# EAGLE design LoopAmp (EAGLE 9.0.0)
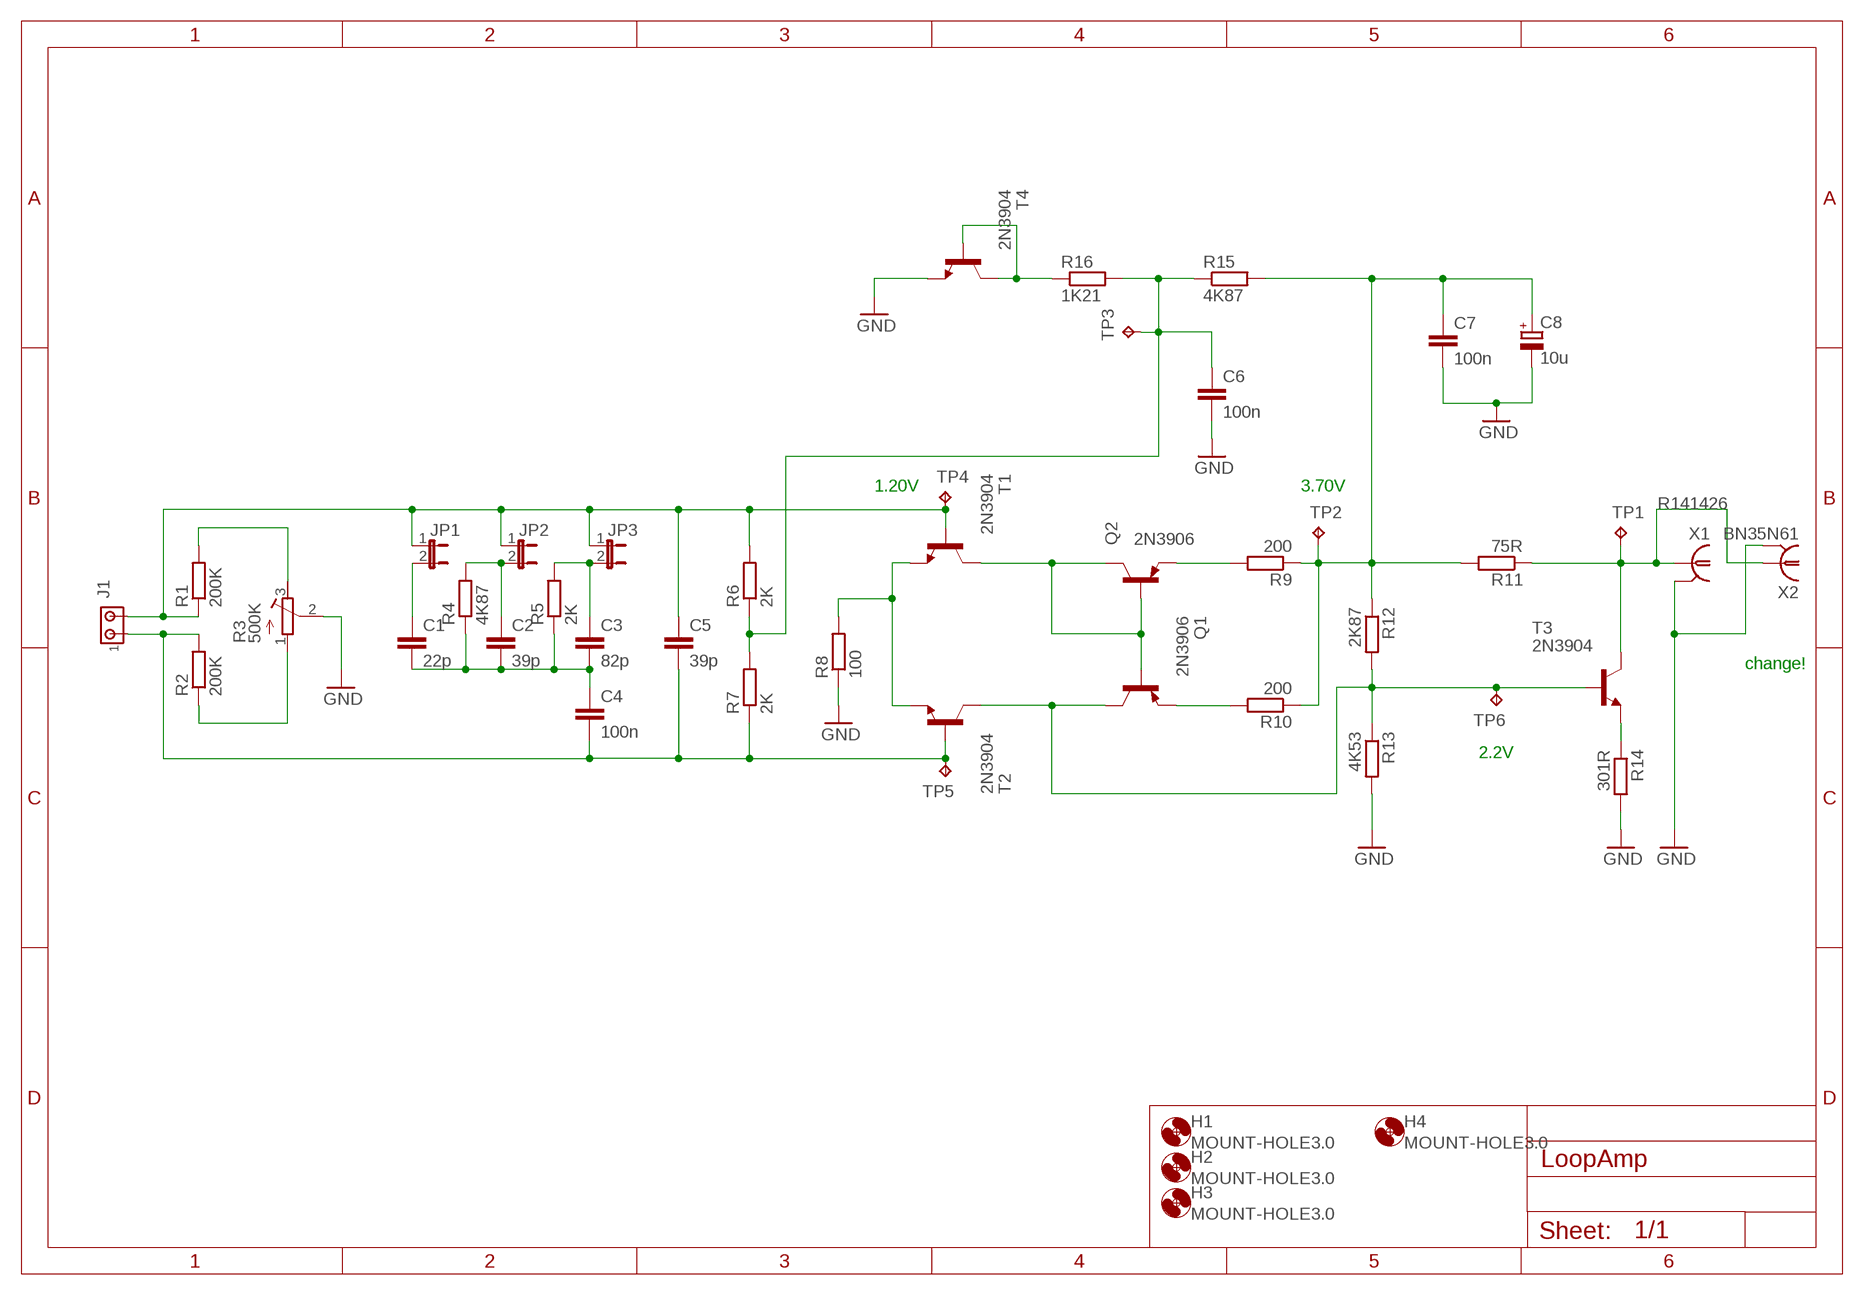
[diagram p0: schematic, sheet 1]

## Parts
C1  22p  C-EUC0805  [C0805]
C2  39p  C-EUC0805  [C0805]
C3  82p  C-EUC0805  [C0805]
C4  100n  C-EUC0805  [C0805]
C5  39p  C-EUC0805  [C0805]
C6  100n  C-EUC0805  [C0805]
C7  100n  C-EUC0805  [C0805]
C8  10u  CPOL-EUC  [PANASONIC_C]
H1  MOUNT-HOLE3.0  [3,0]
H2  MOUNT-HOLE3.0  [3,0]
H3  MOUNT-HOLE3.0  [3,0]
H4  MOUNT-HOLE3.0  [3,0]
J1  MTA02-156  [1X2MTA]
JP1  JP1E  [JP1]
JP2  JP1E  [JP1]
JP3  JP1E  [JP1]
Q1  2N3906  [TO92]
Q2  2N3906  [TO92]
R1  200K  R-EU_R0805  [R0805]
R2  200K  R-EU_R0805  [R0805]
R3  500K  R-TRIMM64W  [RTRIM64W]
R4  4K87  R-EU_R0805  [R0805]
R5  2K  R-EU_R0805  [R0805]
R6  2K  R-EU_R0805  [R0805]
R7  2K  R-EU_R0805  [R0805]
R8  100  R-EU_R0805  [R0805]
R9  200  R-EU_R0805  [R0805]
R10  200  R-EU_R0805  [R0805]
R11  75R  R-EU_R0805  [R0805]
R12  2K87  R-EU_R0805  [R0805]
R13  4K53  R-EU_R0805  [R0805]
R14  301R  R-EU_R0805  [R0805]
R15  4K87  R-EU_R0805  [R0805]
R16  1K21  R-EU_R0805  [R0805]
T1  2N3904  [TO92]
T2  2N3904  [TO92]
T3  2N3904  [TO92]
T4  2N3904  [TO92]
TP1  4.18V>  TPPAD1-13  [P1-13]
TP2  4.18V>  TPPAD1-13  [P1-13]
TP3  4.18V>  TPPAD1-13  [P1-13]
TP4  4.18V>  TPPAD1-13  [P1-13]
TP5  4.18V>  TPPAD1-13  [P1-13]
TP6  4.18V>  TPPAD1-13  [P1-13]
X1  R141426  [R141426]
X2  BN35N61  [B35N61]

## Nets
GND: C6.2 C7.2 C8.- R3.2(S) R8.1 R13.2 R14.2 T4.3(E) X1.2 X1.3 X1.4 X1.5 X2.2 X2.3 X2.4 X2.5
N$2: C4.2 C5.2 J1.1 R2.2 R7.1 T2.2(B) TP5.TP
N$3: C5.1 J1.2 JP1.1 JP2.1 JP3.1 R1.1 R6.2 T1.2(B) TP4.TP
N$4: R2.1 R3.1(A)
N$5: C1.1 JP1.2
N$6: C2.1 JP2.2 R4.2
N$7: C3.1 JP3.2 R5.2
N$8: C1.2 C2.2 C3.2 C4.1 R4.1 R5.1
N$9: R1.2 R3.3(E)
N$11: R8.2 T1.3(E) T2.3(E)
N$14: Q1.2(B) Q2.1(C) Q2.2(B) T1.1(C)
N$15: R11.1 T3.1(C) TP1.TP X1.1 X2.1
N$16: C7.1 C8.+ R9.1 R10.1 R11.2 R12.1 R15.2 TP2.TP
N$17: Q2.3(E) R9.2
N$18: Q1.3(E) R10.2
N$20: Q1.1(C) R12.2 R13.1 T2.1(C) T3.2(B) TP6.TP
N$21: R14.1 T3.3(E)
N$23: C6.1 R6.1 R7.2 R15.1 R16.2 TP3.TP
N$24: R16.1 T4.1(C) T4.2(B)

## Notes on the sheet
- 1.20V | 3.70V
- change!
- 2.2V

## Library data of the parts
C1-C7 = rcl:C-EU: CAPACITOR, European symbol; SPICEPREFIX: C
C8 = rcl:CPOL-EU: POLARIZED CAPACITOR, European symbol; SPICEPREFIX: C
H1-H4 = holes:MOUNT-HOLE: MOUNTING HOLE with drill center marker
J1 = con-amp:MTA02-156: AMP connector
JP1-JP3 = jumper:JP1E: JUMPER
Q1 Q2 = transistor-pnp:2N3906: PNP Transistor
R1 R2 R4-R16 = rcl:R-EU_: RESISTOR, European symbol; SPICEPREFIX: R
R3 = rcl:R-TRIMM: Trimm resistor; SPICEMODEL: X; SPICEPREFIXL: POT
T1-T4 = transistor:2N3904: NPN TRANSISTOR
TP1-TP6 = testpad:TP: Test pad
X1 = con-coax:R141426: BNC COAX CONNECTOR Radiall 50/75 Ohm Spoerle; MF: FARNELL; MPN: R141426161; OC_FARNELL: 4195115; OC_NEWARK: 14J7919
X2 = con-coax:BN35N61: BNC CONNECTOR M/A COM www.macom.com distributor Farnell 149-452; OC_FARNELL: unknown; OC_NEWARK: unknown

## Net classes
0 default: width 0.254 mm

## Board
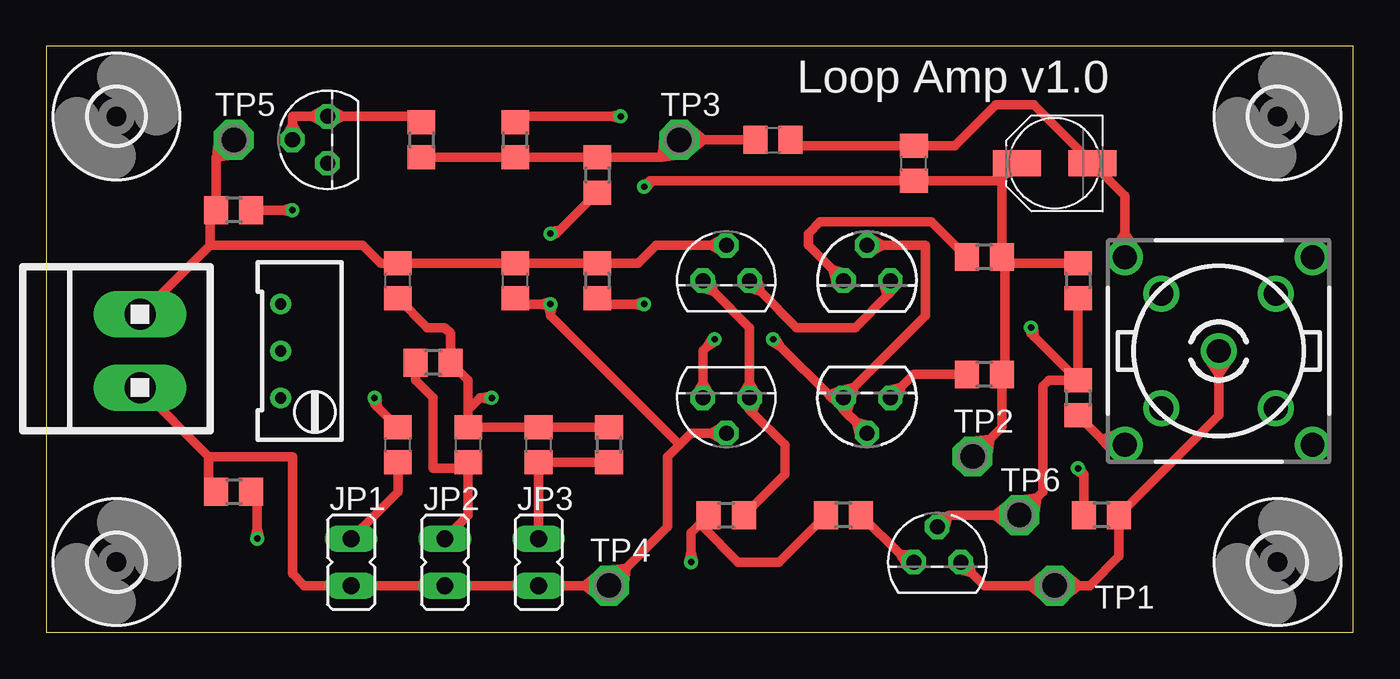
[diagram p1: board, top side]
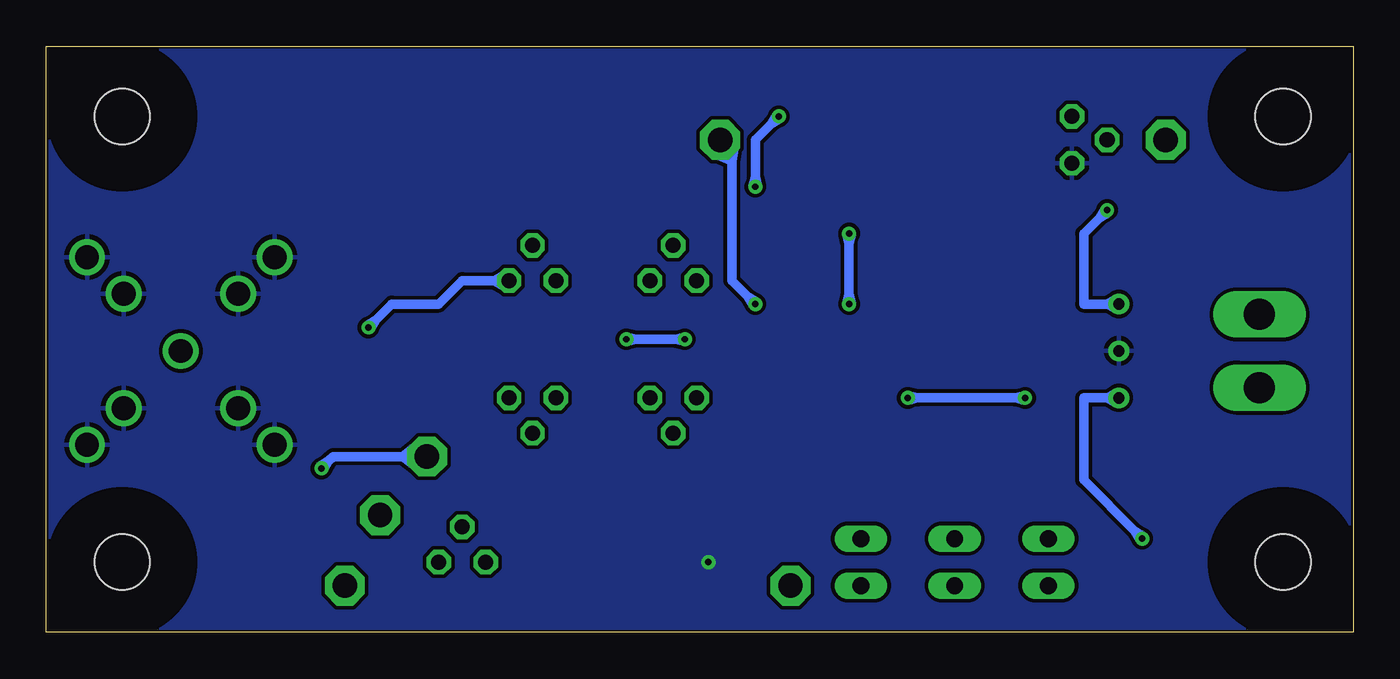
[diagram p2: board, bottom side, seen from below]

Size 70.79 x 31.74 mm. Coordinates in mm from the lower left corner, seen from the top.
Outline: 0,0 70.79,0 70.79,31.74 0,31.74 0,0
Copper layers (1*16): Top 0.035mm / dielectric 1.5mm / Bottom 0.035mm
Design rules "default *": minimum track width 6mil, minimum drill 0.35mm, track to track 8mil, track to pad 8mil, pad to pad 8mil, via to via 8mil, smd to smd 6mil, copper to edge 5mil, drill to drill 6mil, minimum pad ring 10mil, minimum via ring 8mil, stop-mask expansion 4mil, vias tented up to drill 0mil, thermal gap 10mil

### Footprints (pad centres in the part's own frame; a part is rotated, then mirrored left to right if it is on the bottom)
C0805 = smd 1.3 x 1.5: 1 -0.95,0; 2 0.95,0
PANASONIC_C = smd 2.6 x 1.4: + 2.05,0; - -2.05,0
3,0 = hole 3: 0,0
1X2MTA = drill 1.676 long: 1 1.981,0; 2 -1.981,0
JP1 = drill 0.914 long: 1 0,-1.27; 2 0,1.27
TO92 = drill 0.813 octagon: 1 1.27,0; 2 0,1.905; 3 -1.27,0
R0805 = smd 1.3 x 1.5: 1 -0.95,0; 2 0.95,0
RTRIM64W = drill 0.61: 1 1.27,-2.54; 2 1.27,0; 3 1.27,2.54
P1-13 = drill 1.321 pad 2.159 octagon: TP 0,0
R141426 = drill 1.295: 1 0,0; 2 5.08,5.08; 3 -5.08,5.08; 4 -5.08,-5.08; 5 5.08,-5.08
B35N61 = drill 1.2: 1 0,0 | drill 1.3: 2 3.099,3.099; 3 -3.099,3.099; 4 -3.099,-3.099; 5 3.099,-3.099

### Placement (x,y rotation side)
C1  19.05,10.16 90 top
C2  22.86,10.16 90 top
C3  26.67,10.16 90 top
C4  19.05,19.05 90 top
C5  25.4,19.05 90 top
C6  39.37,26.67 0 top
C7  46.99,25.4 90 top
C8  54.61,25.4 180 top
H1  66.67,27.94 0 top
H2  66.67,3.81 0 top
H3  3.81,3.81 0 top
H4  3.81,27.94 0 top
J1  5.08,15.24 90 top
JP1  16.51,3.81 0 top
JP2  21.59,3.81 0 top
JP3  26.67,3.81 0 top
Q1  44.45,19.05 0 top
Q2  44.45,12.7 180 top
R1  10.16,7.62 0 top
R2  10.16,22.86 180 top
R3  13.97,15.24 180 top
R4  20.95,14.61 180 top
R5  30.48,10.16 270 top
R6  29.84,24.77 270 top
R7  29.84,19.05 270 top
R8  36.83,6.35 0 top
R9  50.8,13.97 180 top
R10  50.8,20.32 180 top
R11  57.15,6.35 180 top
R12  55.88,19.05 270 top
R13  55.88,12.7 270 top
R14  43.18,6.35 180 top
R15  25.4,26.67 90 top
R16  20.32,26.67 270 top
T1  36.83,12.7 180 top
T2  36.83,19.05 0 top
T3  48.26,3.81 0 top
T4  15.24,26.67 90 top
TP1  54.61,2.54 0 top
TP2  50.16,9.53 0 top
TP3  34.29,26.67 0 top
TP4  30.48,2.54 0 top
TP5  10.16,26.67 0 top
TP6  52.7,6.35 0 top
X1  63.5,15.24 180 top
X2  63.5,15.24 0 top

### Tracks (layer width: path | path; a pad name or v marks a point on that pad's centre or on a via)
GND  (via drill 0.35)
  Top 0.508: C6.2 40.64,26.35 C7.2 49.21,26.35 51.44,28.57 53.48,28.57 C8.- 58.42,23.64 58.42,21.61 | 42.55,6.67 R14.2 39.69,3.81 37.47,3.81 35.56,5.71 35.88,6.04 R8.1 34.92,5.39 34.92,4.33 | R13.2 57.16,10.47 | 57.16,10.47 57.47,10.16 X1.2 | 34.92,4.33 v34.92,3.81 | 58.42,21.61 X1.5 | 34.92,4.33 34.8,3.84 v34.92,3.81 | 34.92,4.33 35.05,3.84 v34.92,3.81 | 57.16,10.47 57.89,9.67 X1.2 | 57.16,10.47 58.18,10.84 X1.2 | 58.42,21.61 57.82,20.72 X1.5 | 58.42,21.61 59.02,20.72 X1.5
  pour Bottom: -1.27,-1.27 -1.27,33.02 76.2,33.02 76.2,-1.27
N$2
  Top 0.508: J1.1 5.16,17.22 8.89,20.95 | 8.89,20.95 17.14,20.95 18.1,20 C4.2 C5.2 R7.1 32.06,20 33.02,20.95 36.02,20.95 | 36.02,20.95 T2.2 | 8.89,20.95 8.89,22.54 R2.2 9.21,25.72 9.23,25.74 | 9.23,25.74 TP5.TP | 36.02,20.95 36.63,20.6 T2.2 | 36.02,20.95 36.63,21.31 T2.2 | 9.23,25.74 10.25,25.85 TP5.TP | 9.23,25.74 9.34,26.76 TP5.TP
N$3  (via drill 0.35)
  Top 0.508: J1.2 8.81,9.53 | 8.81,9.53 13.34,9.53 13.34,3.17 13.97,2.54 JP1.1 JP2.1 JP3.1 29.16,2.54 | 29.16,2.54 TP4.TP | TP4.TP 31.41,3.47 | 31.41,3.47 33.66,5.71 33.66,9.53 34.29,10.16 | 34.29,10.16 34.92,10.79 36.02,10.79 | 36.02,10.79 T1.2 | R1.1 8.81,8.02 8.81,9.53 | R6.2 27.8,21.77 | 27.8,21.77 27.62,21.59 v27.3,21.59 | v27.3,17.78 26.78,17.78 | 26.78,17.78 25.72,17.78 C5.1 | v27.3,17.78 27.3,17.25 | 27.3,17.25 27.3,17.14 34.29,10.16 | 27.8,21.77 27.29,21.71 v27.3,21.59 | 27.8,21.77 27.37,21.49 v27.3,21.59 | 26.78,17.78 27.28,17.66 v27.3,17.78 | 26.78,17.78 27.28,17.9 v27.3,17.78 | 27.3,17.25 27.43,17.75 v27.3,17.78 | 27.3,17.25 27.18,17.75 v27.3,17.78 | 36.02,10.79 36.63,10.44 T1.2 | 36.02,10.79 36.63,11.15 T1.2 | 29.16,2.54 29.96,1.9 TP4.TP | 29.16,2.54 29.96,3.18 TP4.TP | 31.41,3.47 30.39,3.36 TP4.TP | 31.41,3.47 31.3,2.45 TP4.TP
  Bottom 0.508: v27.3,21.59 27.3,21.07 | 27.3,21.07 27.3,18.3 | 27.3,18.3 v27.3,17.78 | 27.3,21.07 27.43,21.56 v27.3,21.59 | 27.3,21.07 27.18,21.56 v27.3,21.59 | 27.3,18.3 27.18,17.81 v27.3,17.78 | 27.3,18.3 27.43,17.81 v27.3,17.78
N$4  (via drill 0.35)
  Top 0.508: R2.1 12.81,22.86 | 12.81,22.86 v13.34,22.86 | 12.81,22.86 13.31,22.74 v13.34,22.86 | 12.81,22.86 13.31,22.98 v13.34,22.86
  Bottom 0.508: v13.34,22.86 13.71,22.49 | 13.71,22.49 14.61,21.59 14.61,17.78 13.31,17.78 | 13.31,17.78 R3.1 | 13.71,22.49 13.44,22.93 v13.34,22.86 | 13.71,22.49 13.27,22.75 v13.34,22.86 | 13.31,17.78 12.85,18.04 R3.1 | 13.31,17.78 12.85,17.52 R3.1
N$5
  Top 0.508: JP1.2 19.05,7.62 C1.1
N$6
  Top 0.508: JP2.2 22.86,6.35 C2.1 22.54,8.89 20.95,8.89 20.95,12.7 20,13.65 R4.2
N$7
  Top 0.508: JP3.2 C3.1 R5.2
N$8  (via drill 0.35)
  Top 0.508: C4.1 20.64,16.51 21.59,16.51 21.91,16.2 R4.1 22.86,13.65 22.86,12.06 | 22.86,12.06 C2.2 C3.2 R5.1 | C1.2 17.95,12.21 | 17.95,12.21 17.78,12.38 v17.78,12.7 | v24.13,12.7 23.61,12.7 | 23.61,12.7 23.5,12.7 22.86,12.06 | 17.95,12.21 17.9,12.71 v17.78,12.7 | 17.95,12.21 17.68,12.63 v17.78,12.7 | 23.61,12.7 24.1,12.58 v24.13,12.7 | 23.61,12.7 24.1,12.82 v24.13,12.7
  Bottom 0.508: v17.78,12.7 18.3,12.7 | 18.3,12.7 23.61,12.7 | 23.61,12.7 v24.13,12.7 | 18.3,12.7 17.81,12.82 v17.78,12.7 | 18.3,12.7 17.81,12.58 v17.78,12.7 | 23.61,12.7 24.1,12.58 v24.13,12.7 | 23.61,12.7 24.1,12.82 v24.13,12.7
N$9  (via drill 0.35)
  Top 0.508: R1.2 11.43,7.3 11.43,5.61 | 11.43,5.61 v11.43,5.08 | 11.43,5.61 11.31,5.11 v11.43,5.08 | 11.43,5.61 11.55,5.11 v11.43,5.08
  Bottom 0.508: v11.43,5.08 11.8,5.45 | 11.8,5.45 14.61,8.26 14.61,12.7 13.31,12.7 | 13.31,12.7 13.22,12.7 | 13.22,12.7 R3.3 | 11.8,5.45 11.37,5.19 v11.43,5.08 | 11.8,5.45 11.54,5.01 v11.43,5.08 | 13.22,12.7 12.73,12.82 R3.3 | 13.22,12.7 12.73,12.58 R3.3 | 13.31,12.7 12.85,12.96 R3.3 | 13.31,12.7 12.85,12.44 R3.3
  other vias: 12.7,12.7
N$11
  Top 0.508: R8.2 40.01,8.57 40.01,10.16 38.26,11.9 | 38.26,11.9 38.1,12.06 T1.3 | T2.3 36.13,18.48 | 36.13,18.48 38.1,16.51 38.1,13.51 | 38.1,13.51 T1.3 | 38.26,11.9 38.48,12.57 T1.3 | 38.26,11.9 37.8,12.43 T1.3 | 38.1,13.51 37.75,12.9 T1.3 | 38.1,13.51 38.45,12.9 T1.3 | 36.13,18.48 35.95,19.16 T2.3 | 36.13,18.48 35.45,18.66 T2.3
N$14  (via drill 0.35)
  Top 0.508: Q2.1 43.76,13.28 | 43.76,13.28 47.62,17.14 47.62,20.95 45.26,20.95 | 45.26,20.95 Q1.2 | T1.1 35.56,13.51 | 35.56,13.51 35.56,15.24 35.82,15.5 | 35.82,15.5 v36.2,15.88 | v39.37,15.88 39.74,15.5 | 39.74,15.5 42.38,12.86 | 42.38,12.86 42.55,12.7 Q2.1 | Q2.2 43.88,11.37 | 43.88,11.37 43.34,11.9 | 43.34,11.9 43.18,12.06 Q2.1 | 35.82,15.5 36.26,15.77 v36.2,15.88 | 35.82,15.5 36.09,15.94 v36.2,15.88 | 39.74,15.5 39.48,15.94 v39.37,15.88 | 39.74,15.5 39.3,15.77 v39.37,15.88 | 43.88,11.37 44.06,10.69 Q2.2 | 43.88,11.37 44.55,11.19 Q2.2 | 45.26,20.95 44.65,21.31 Q1.2 | 45.26,20.95 44.65,20.6 Q1.2 | 35.56,13.51 35.21,12.9 T1.1 | 35.56,13.51 35.91,12.9 T1.1 | 43.76,13.28 43.08,13.09 Q2.1 | 43.76,13.28 43.57,12.6 Q2.1 | 42.38,12.86 42.91,12.39 Q2.1 | 42.38,12.86 43.05,13.09 Q2.1 | 43.34,11.9 43.56,12.57 Q2.1 | 43.34,11.9 42.88,12.43 Q2.1
  Bottom 0.508: v36.2,15.88 36.72,15.88 | 36.72,15.88 38.84,15.88 | 38.84,15.88 v39.37,15.88 | 36.72,15.88 36.22,16 v36.2,15.88 | 36.72,15.88 36.22,15.75 v36.2,15.88 | 38.84,15.88 39.34,15.75 v39.37,15.88 | 38.84,15.88 39.34,16 v39.37,15.88
N$15
  Top 0.508: X2.1 63.5,14.04 | 63.5,14.04 63.5,13.95 | 63.5,13.95 63.5,11.75 R11.1 58.1,4.12 56.52,2.54 55.93,2.54 | 55.93,2.54 TP1.TP | TP1.TP 53.29,2.54 | 53.29,2.54 50.8,2.54 50.1,3.23 | 50.1,3.23 T3.1 | 63.5,13.95 64.1,14.84 X2.1 | 63.5,13.95 62.9,14.84 X2.1 | 50.1,3.23 49.92,3.92 T3.1 | 50.1,3.23 49.42,3.42 T3.1 | 55.93,2.54 55.13,3.18 TP1.TP | 55.93,2.54 55.13,1.9 TP1.TP | 53.29,2.54 54.09,1.9 TP1.TP | 53.29,2.54 54.09,3.18 TP1.TP | 63.5,14.04 64.04,14.89 X2.1 | 63.5,14.04 62.96,14.89 X2.1
N$16  (via drill 0.35)
  Top 0.508: 32.8,24.45 C7.1 51.61,24.45 51.75,24.59 | 32.8,24.45 32.7,24.45 v32.38,24.13 | v31.11,27.94 30.59,27.94 | 30.59,27.94 25.72,27.94 R15.2 | 51.75,24.59 R10.1 51.91,20.16 | 51.75,24.59 C8.+ | 51.1,10.46 51.75,11.11 R9.1 51.91,14.13 51.91,20.16 | 51.1,10.46 TP2.TP | v55.88,8.89 56.2,8.57 56.2,8.47 | 56.2,8.47 R11.2 | 51.91,20.16 52.07,20 R12.1 | 32.8,24.45 32.34,24.24 v32.38,24.13 | 32.8,24.45 32.48,24.05 v32.38,24.13 | 30.59,27.94 31.09,27.82 v31.11,27.94 | 30.59,27.94 31.09,28.06 v31.11,27.94 | 56.2,8.47 55.99,8.94 v55.88,8.89 | 56.2,8.47 55.8,8.79 v55.88,8.89 | 51.1,10.46 50.07,10.35 TP2.TP | 51.1,10.46 50.98,9.43 TP2.TP
  Bottom 0.508: v32.38,24.13 32.38,24.66 | 32.38,24.66 32.38,26.67 31.49,27.57 | 31.49,27.57 v31.11,27.94 | TP2.TP 51.49,9.53 | 51.49,9.53 55.24,9.53 55.51,9.26 | 55.51,9.26 v55.88,8.89 | 32.38,24.66 32.26,24.16 v32.38,24.13 | 32.38,24.66 32.51,24.16 v32.38,24.13 | 31.49,27.57 31.22,28 v31.11,27.94 | 31.49,27.57 31.05,27.83 v31.11,27.94 | 55.51,9.26 55.77,8.82 v55.88,8.89 | 55.51,9.26 55.95,9 v55.88,8.89 | 51.49,9.53 50.68,10.17 TP2.TP | 51.49,9.53 50.68,8.88 TP2.TP
N$17
  Top 0.508: Q2.3 46.3,13.28 | 46.3,13.28 46.99,13.97 R9.2 | 46.3,13.28 45.62,13.09 Q2.3 | 46.3,13.28 46.11,12.6 Q2.3
N$18
  Top 0.508: R10.2 47.95,22.23 41.91,22.23 41.27,21.59 41.27,20.95 42.6,19.62 | 42.6,19.62 Q1.3 | 42.6,19.62 42.79,18.95 Q1.3 | 42.6,19.62 43.28,19.44 Q1.3
N$20  (via drill 0.35)
  Top 0.508: T3.2 48.84,6.29 | 48.84,6.29 48.9,6.35 51.38,6.35 | 51.38,6.35 TP6.TP | TP6.TP 53.64,7.28 | 53.64,7.28 53.98,7.62 53.98,13.34 54.29,13.65 R13.1 | T2.1 38.67,18.48 | 38.67,18.48 40.64,16.51 43.81,16.51 45.56,18.25 | 45.56,18.25 45.72,18.41 Q1.1 | R13.1 R12.2 | R13.1 53.52,16.02 | 53.52,16.02 53.34,16.19 v53.34,16.51 | 53.52,16.02 53.46,16.52 v53.34,16.51 | 53.52,16.02 53.24,16.44 v53.34,16.51 | 45.56,18.25 46.02,18.78 Q1.1 | 45.56,18.25 45.34,18.92 Q1.1 | 38.67,18.48 38.49,19.16 T2.1 | 38.67,18.48 37.99,18.66 T2.1 | 48.84,6.29 48.16,6.11 T3.2 | 48.84,6.29 48.65,5.61 T3.2 | 51.38,6.35 52.19,5.71 TP6.TP | 51.38,6.35 52.19,6.99 TP6.TP | 53.64,7.28 52.61,7.17 TP6.TP | 53.64,7.28 53.52,6.26 TP6.TP
  Bottom 0.508: v53.34,16.51 52.97,16.88 | 52.97,16.88 52.07,17.78 49.53,17.78 48.26,19.05 46.53,19.05 | 46.53,19.05 Q1.1 | 52.97,16.88 53.23,16.45 v53.34,16.51 | 52.97,16.88 53.41,16.62 v53.34,16.51 | 46.53,19.05 45.92,19.4 Q1.1 | 46.53,19.05 45.92,18.7 Q1.1
N$21
  Top 0.508: R14.1 46.28,4.2 | 46.28,4.2 46.67,3.81 T3.3 | 46.28,4.2 46.64,3.6 T3.3 | 46.28,4.2 46.98,4.22 T3.3
N$23  (via drill 0.35)
  Top 0.508: R16.2 R15.1 R6.1 33.34,25.71 33.36,25.74 | 33.36,25.74 TP3.TP | C6.1 35.61,26.67 | 35.61,26.67 TP3.TP | R7.2 30.16,17.78 31.86,17.78 | 31.86,17.78 v32.38,17.78 | 31.86,17.78 32.36,17.66 v32.38,17.78 | 31.86,17.78 32.36,17.9 v32.38,17.78 | 33.36,25.74 34.38,25.85 TP3.TP | 33.36,25.74 33.47,26.76 TP3.TP | 35.61,26.67 34.81,27.31 TP3.TP | 35.61,26.67 34.81,26.03 TP3.TP
  Bottom 0.508: v32.38,17.78 32.76,18.15 | 32.76,18.15 33.66,19.05 33.66,25.51 | TP3.TP 33.66,26.04 33.66,25.51 | 32.76,18.15 32.32,17.89 v32.38,17.78 | 32.76,18.15 32.49,17.71 v32.38,17.78 | 33.66,25.51 34.61,25.91 TP3.TP | 33.66,25.51 33.48,26.53 TP3.TP
N$24
  Top 0.508: T4.2 13.34,27.48 | 13.34,27.48 13.34,27.94 14.43,27.94 | 14.43,27.94 T4.1 | T4.1 16.05,27.94 | 16.05,27.94 20,27.94 R16.1 | 14.43,27.94 15.04,27.59 T4.1 | 14.43,27.94 15.04,28.29 T4.1 | 16.05,27.94 15.44,28.29 T4.1 | 16.05,27.94 15.44,27.59 T4.1 | 13.34,27.48 12.98,26.87 T4.2 | 13.34,27.48 13.69,26.87 T4.2

### Text on the board
tNames: Loop Amp v1.0